# Altium schematic sheet lora.SchDoc
size A0
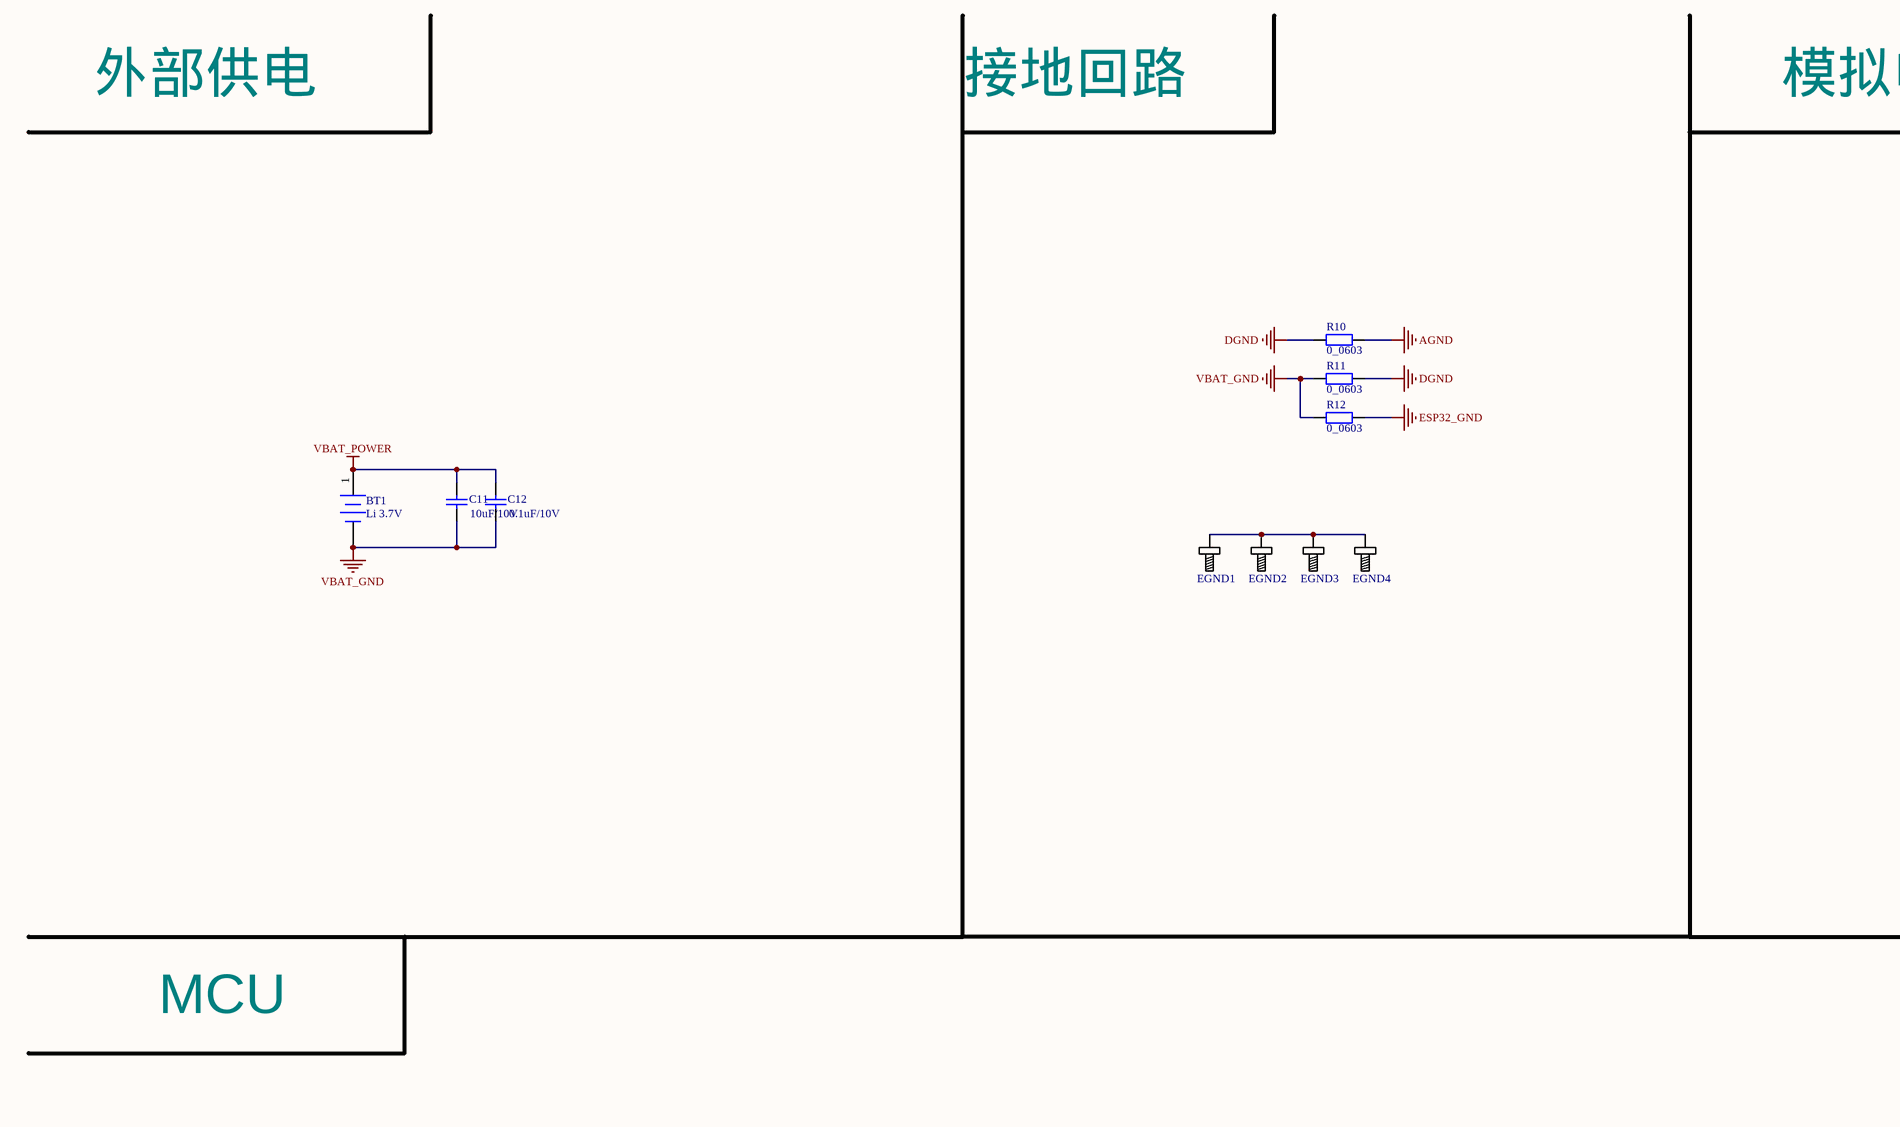
[diagram p0: lora.SchDoc, top left]
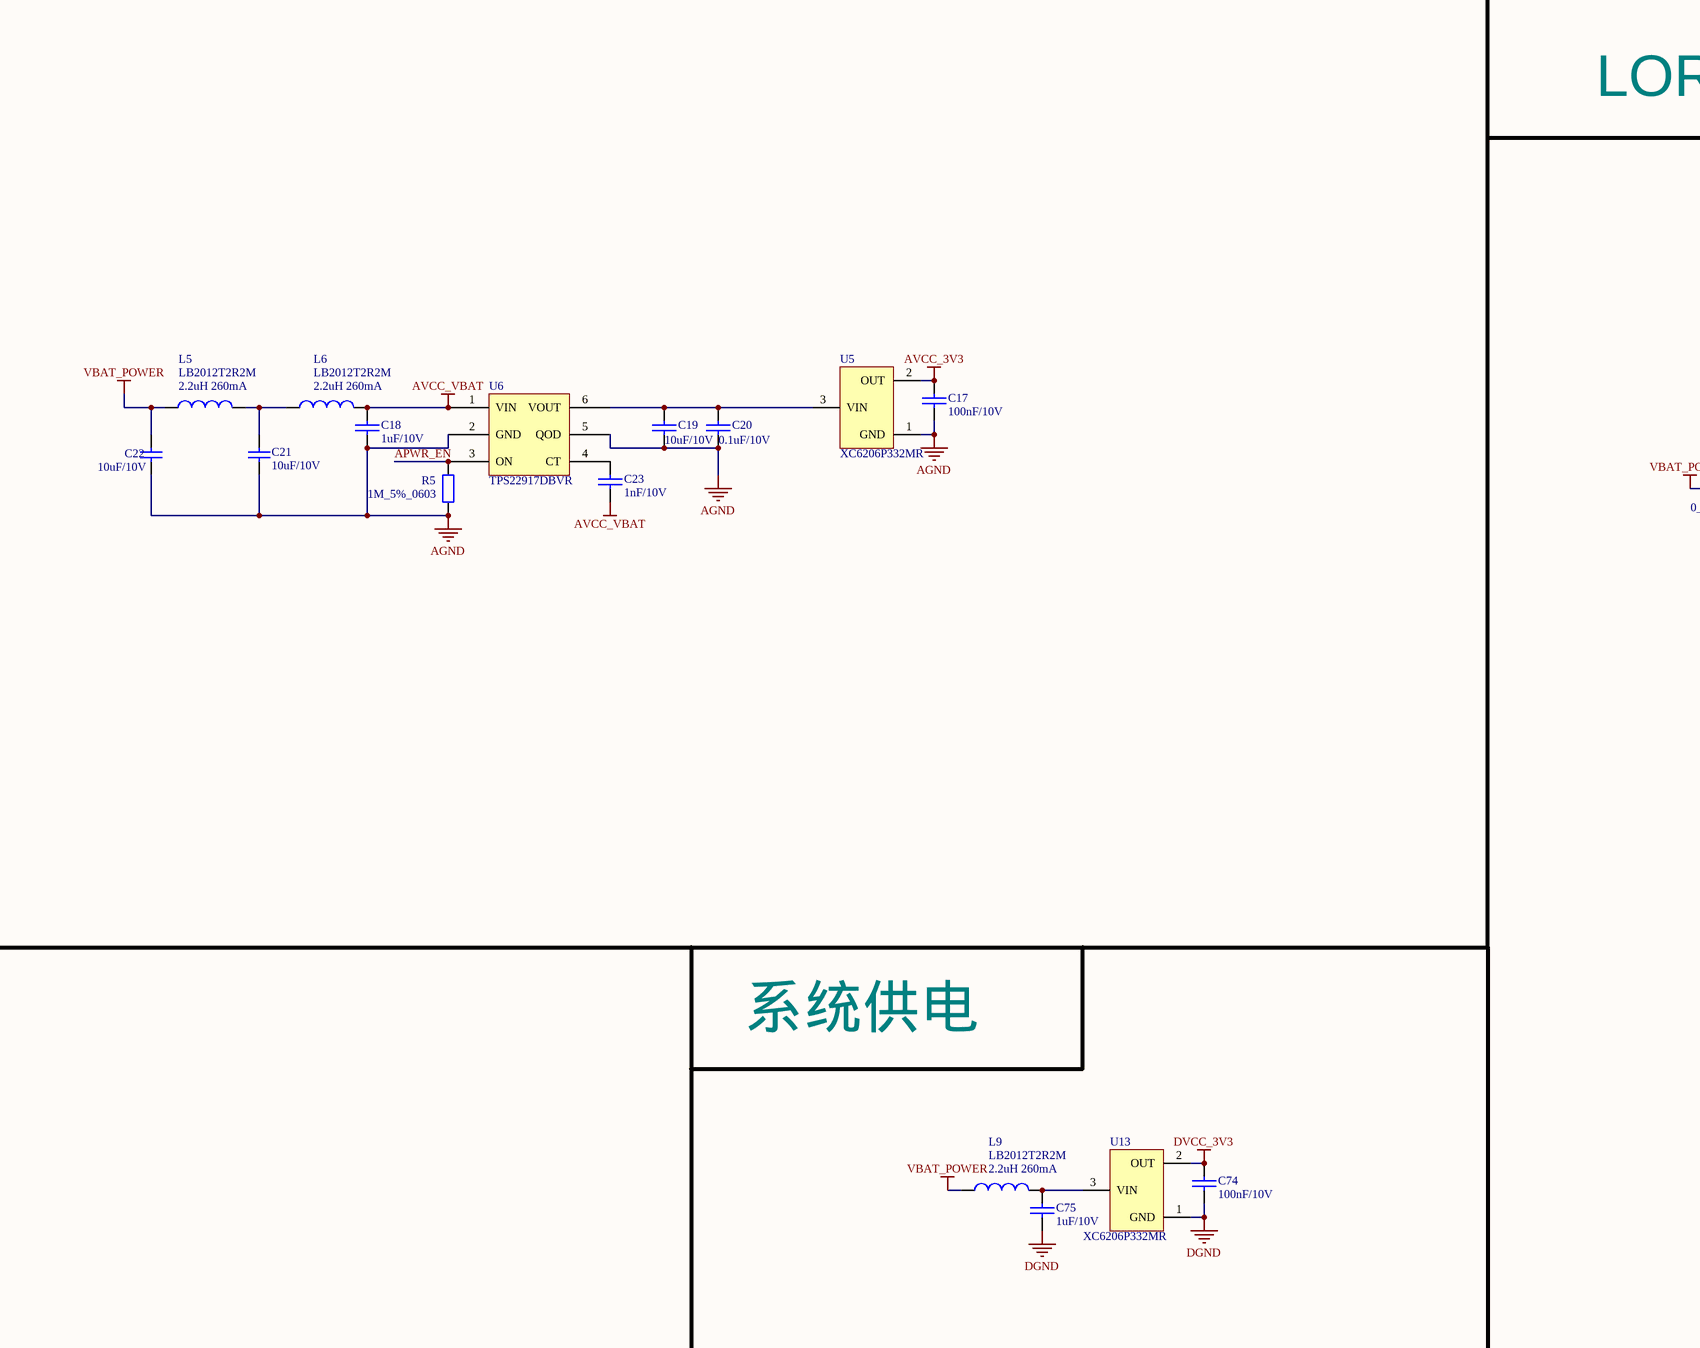
[diagram p1: lora.SchDoc, top middle]
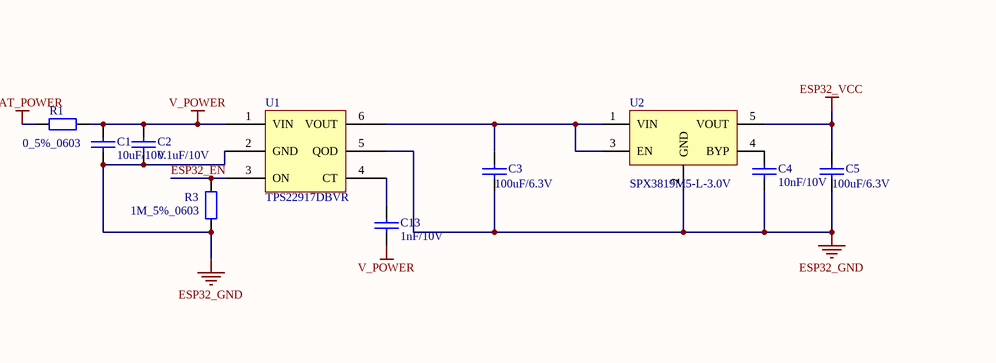
[diagram p2: lora.SchDoc, top right]
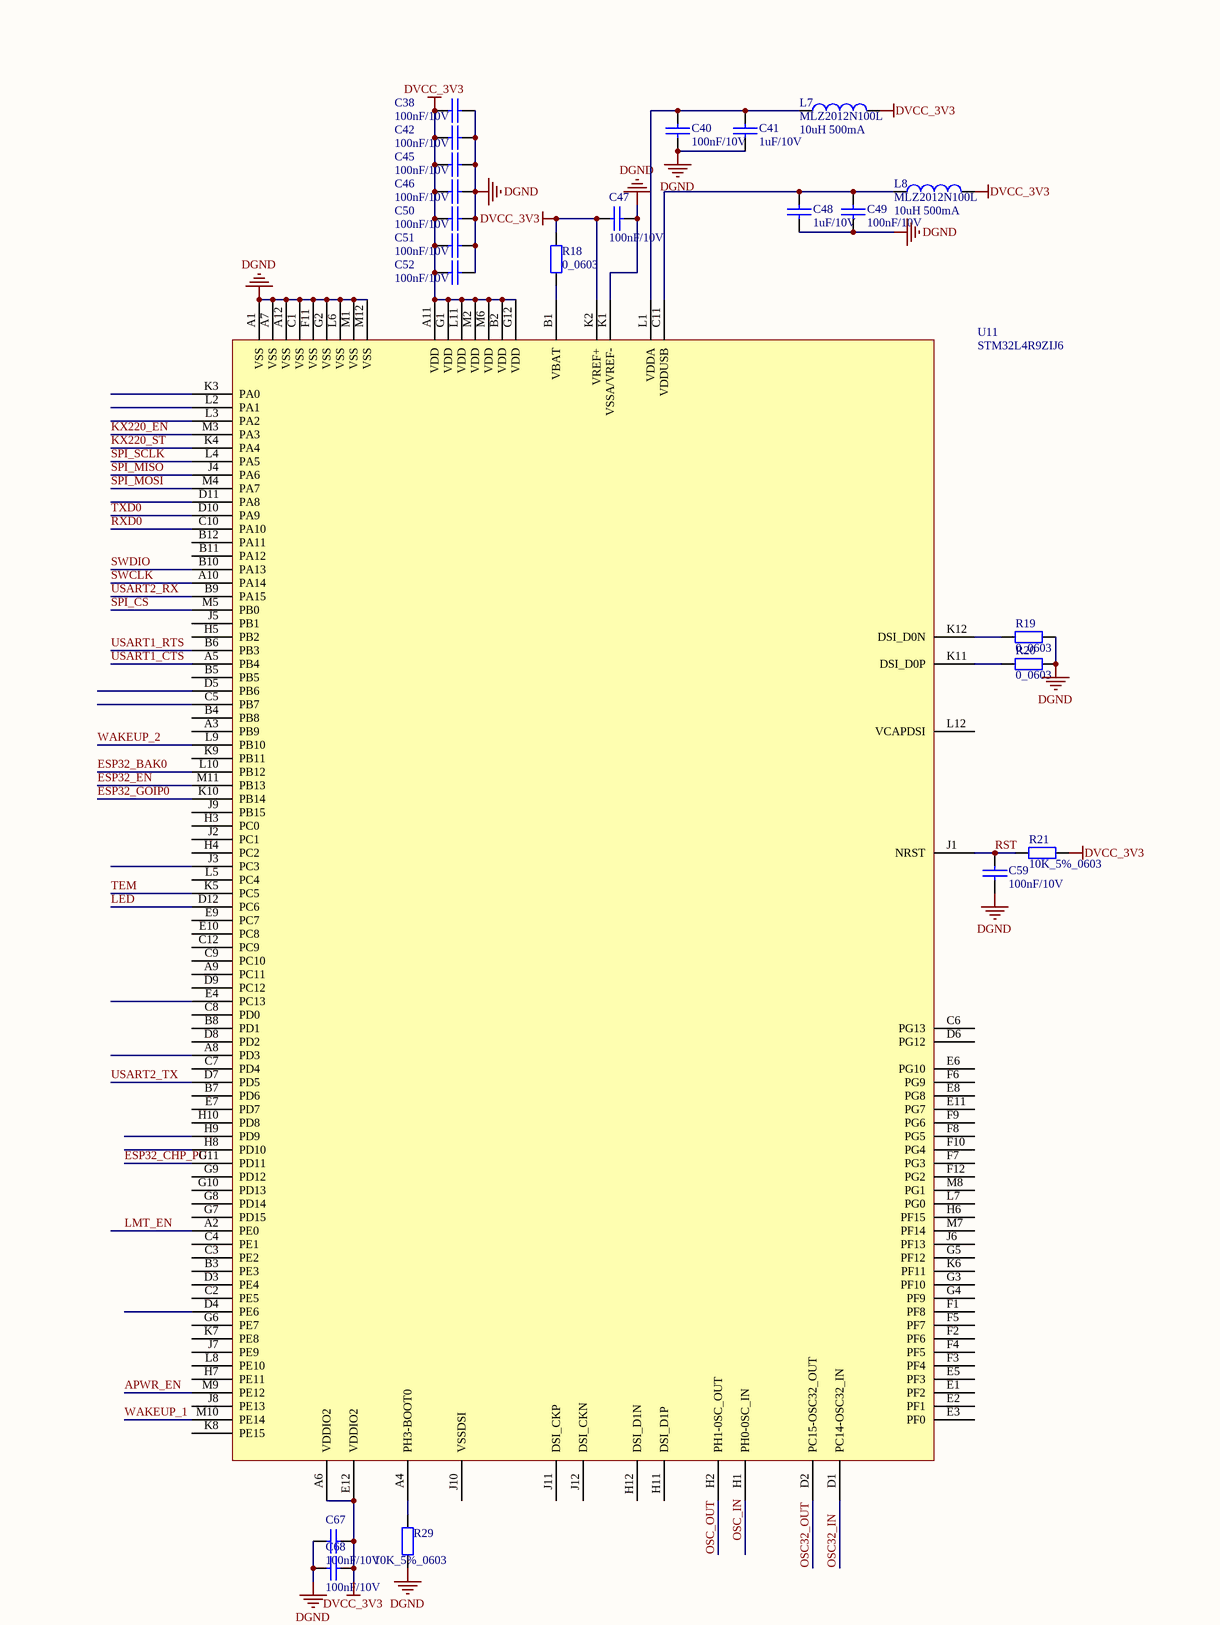
[diagram p3: lora.SchDoc, centre left]
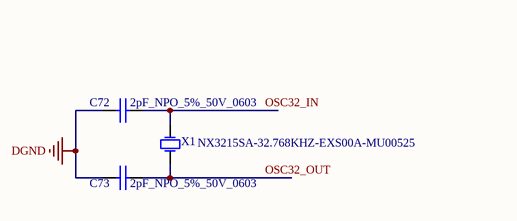
[diagram p4: lora.SchDoc, centre middle]
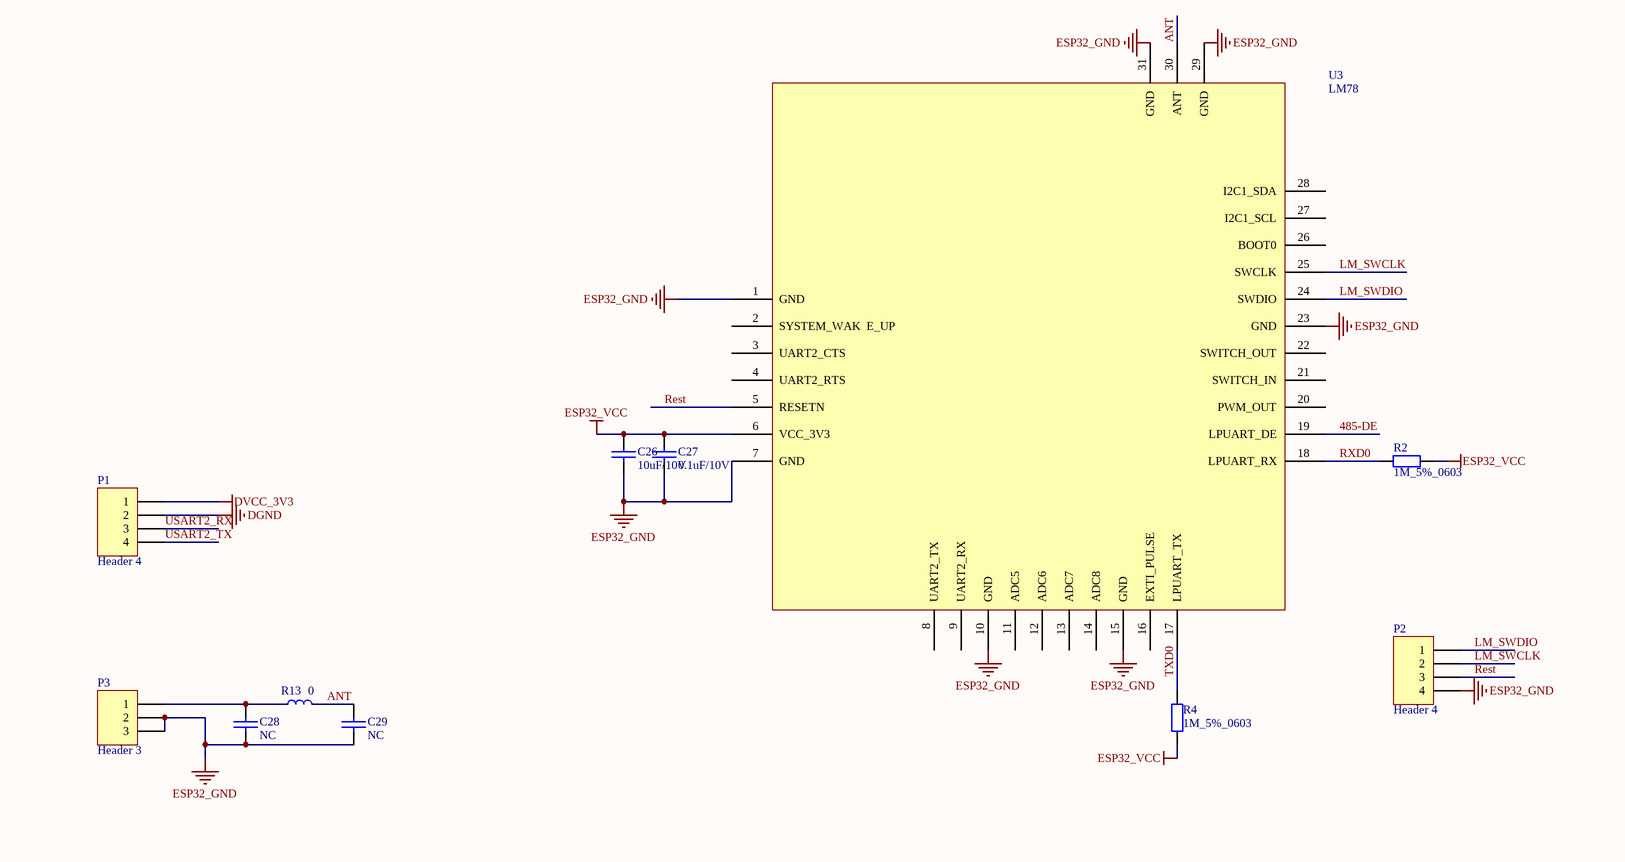
[diagram p5: lora.SchDoc, centre right]
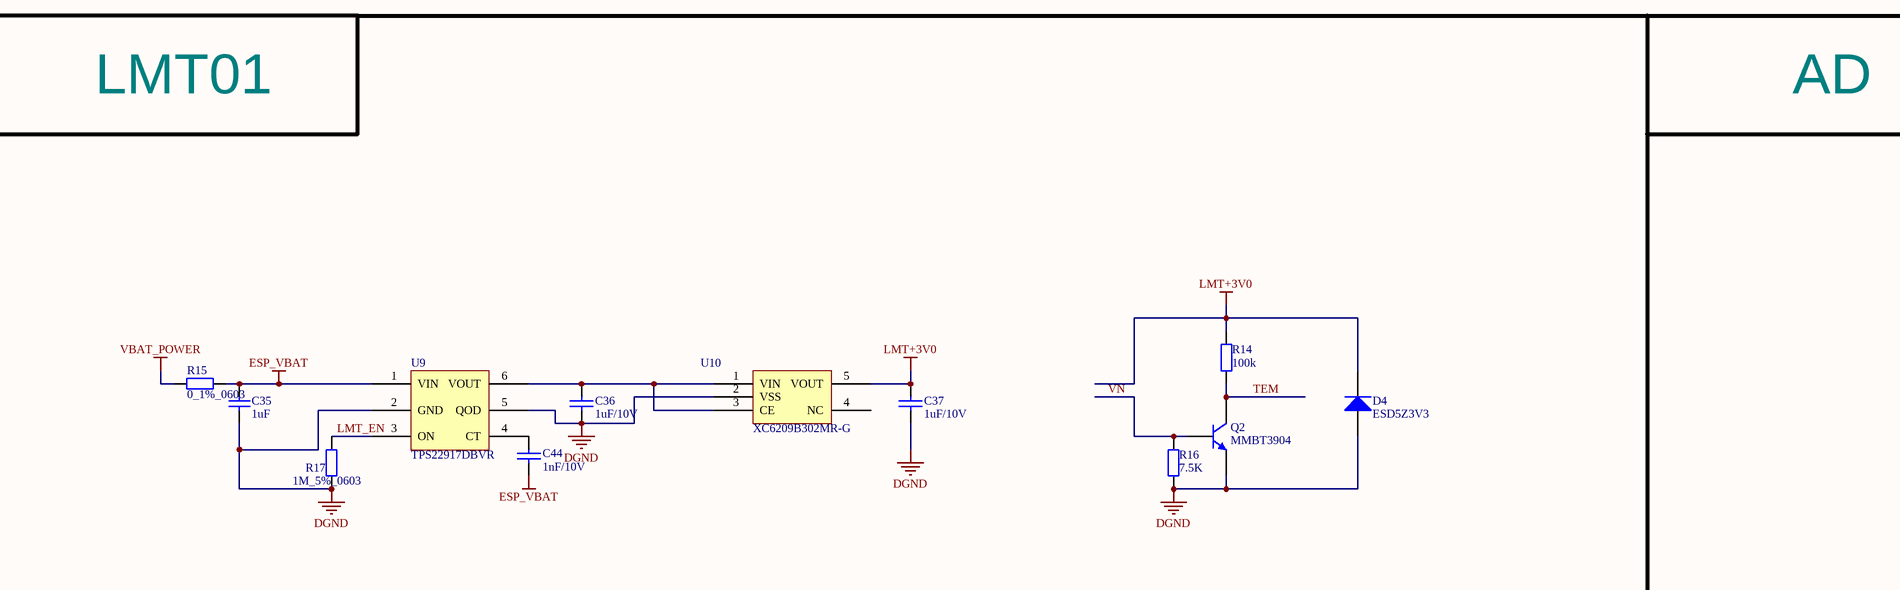
[diagram p6: lora.SchDoc, bottom left]
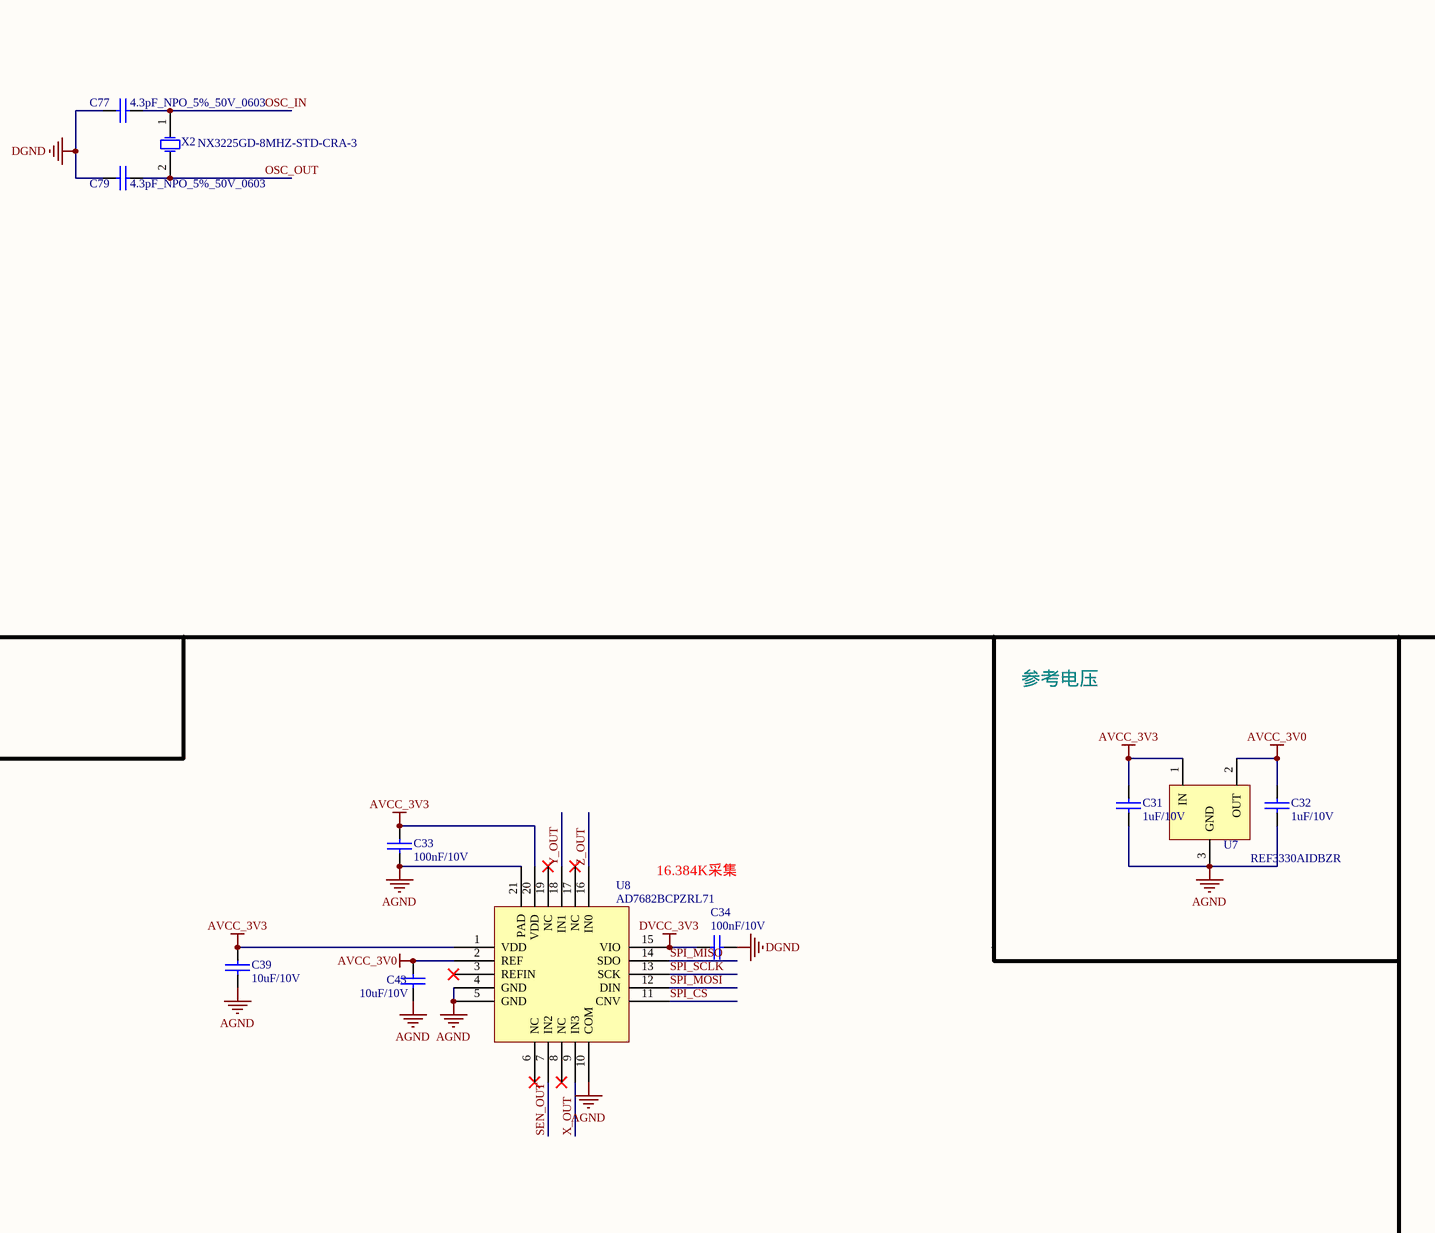
[diagram p7: lora.SchDoc, bottom middle]
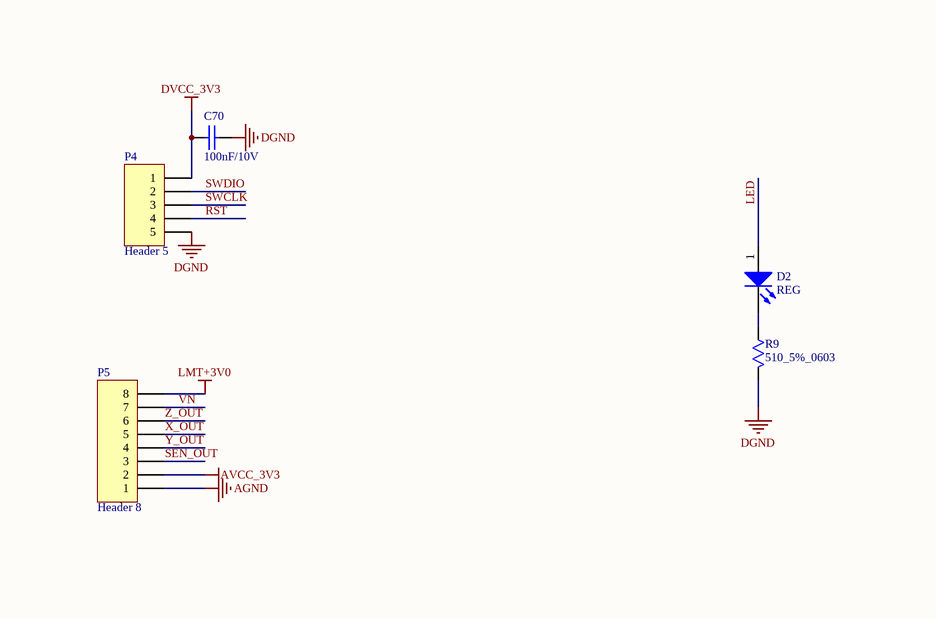
[diagram p8: lora.SchDoc, bottom right]

## Parts
BT1  Li 3.7V  [PH2.0-WI-2P]
C1  10uF/10V  [0603C]
C2  0.1uF/10V  [0603C]
C3  100uF/6.3V  [1206C]
C4  10nF/10V  [0603C]
C5  100uF/6.3V  [1206C]
C11  10uF/10V  [0603C]
C12  0.1uF/10V  [0603C]
C13  1nF/10V  [0603C]
C17  100nF/10V  [0603C]
C18  1uF/10V  [0603C]
C19  10uF/10V  [0603C]
C20  0.1uF/10V  [0603C]
C21  10uF/10V  [0603C]
C22  10uF/10V  [0603C]
C23  1nF/10V  [0603C]
C26  10uF/10V  [0603C]
C27  0.1uF/10V  [0603C]
C28  NC  [0603C]  (no BOM)
C29  NC  [0603C]  (no BOM)
C31  1uF/10V  [0603C]
C32  1uF/10V  [0603C]
C33  100nF/10V  [0402C]
C34  100nF/10V  [0603C]
C35  1uF  [0603C]
C36  1uF/10V  [0603C]
C37  1uF/10V  [0603C]
C38  100nF/10V  [0603C]
C39  10uF/10V  [0402C]
C40  100nF/10V  [0603C]
C41  1uF/10V  [0603C]
C42  100nF/10V  [0603C]
C43  10uF/10V  [0402C]
C44  1nF/10V  [0603C]
C45  100nF/10V  [0603C]
C46  100nF/10V  [0603C]
C47  100nF/10V  [0603C]
C48  1uF/10V  [0603C]
C49  100nF/10V  [0603C]
C50  100nF/10V  [0603C]
C51  100nF/10V  [0603C]
C52  100nF/10V  [0603C]
C59  100nF/10V  [0603C]
C67  100nF/10V  [0603C]
C68  100nF/10V  [0603C]
C70  100nF/10V  [0603C]
C72  2pF_NPO_5%_50V_0603  [0603C]
C73  2pF_NPO_5%_50V_0603  [0603C]
C74  100nF/10V  [0603C]
C75  1uF/10V  [0603C]
C77  4.3pF_NPO_5%_50V_0603  [0603C]
C79  4.3pF_NPO_5%_50V_0603  [0603C]
D2  REG  [LED 0805B]
D4  ESD5Z3V3  [SOD-523]
EGND1  EGND  [M2.5x4]  (value not drawn)  (no BOM)
EGND2  EGND  [M2.5x4]  (value not drawn)  (no BOM)
EGND3  EGND  [M2.5x4]  (value not drawn)  (no BOM)
EGND4  EGND  [M2.5x4]  (value not drawn)  (no BOM)
L5  LB2012T2R2M  value 2.2uH 260mA  [L 0805]
L6  LB2012T2R2M  value 2.2uH 260mA  [L 0805]
L7  MLZ2012N100L  value 10uH 500mA  [L 0805]
L8  MLZ2012N100L  value 10uH 500mA  [L 0805]
L9  LB2012T2R2M  value 2.2uH 260mA  [L 0805]
P1  Header 4  [HDR2.0-LI-4P]
P2  Header 4  [HDR2.0-LI-4P]
P3  Header 3  [SMA-KE]
P4  Header 5  [HDR2.0-LI-5P]
P5  Header 8  [FPC1.0-2H-WS-8P]
Q2  MMBT3904  [SOT23-3N]
R1  0_5%_0603  [0603R]
R2  1M_5%_0603  [0603R]
R3  1M_5%_0603  [0603R]
R4  1M_5%_0603  [0603R]
R5  1M_5%_0603  [0603R]
R9  510_5%_0603  [0603R]
R10  0_0603  [0603R]
R11  0_0603  [0603R]
R12  0_0603  [0603R]
R13  0  [0603R]
R14  100k  [0603R]
R15  0_1%_0603  [0603R]
R16  7.5K  [0603R]
R17  1M_5%_0603  [0603R]
R18  0_0603  [0603R]
R19  0_0603  [0603R]
R20  0_0603  [0603R]
R21  10K_5%_0603  [0603R]
R29  10K_5%_0603  [0603R]
U1  TPS22917DBVR  [SOT23-6]
U2  SPX3819M5-L-3.0V  [SOT23-5]
U3  LM78  [LM78]
U5  XC6206P332MR  [SOT23-3N]
U6  TPS22917DBVR  [SOT23-6]
U7  REF3330AIDBZR  [SOT23-3N]
U8  AD7682BCPZRL71  [LFCSP-20]
U9  TPS22917DBVR  [SOT23-6]
U10  XC6209B302MR-G  [SOT23-5]
U11  STM32L4R9ZIJ6  [UFBGA144]
U13  XC6206P332MR  [SOT23-3N]
X1  NX3215SA-32.768KHZ-EXS00A-MU00525  [OSC 3215-2P]
X2  NX3225GD-8MHZ-STD-CRA-3  [OSC 3225-2P]

## Nets
AGND: C17.2 C18.2 C19.2 C20.2 C21.2 C22.2 C31.2 C32.2 C33.2 C39.2 C43.2 P5.1 R5.2 R10.1 U5.1(GND) U6.2(GND) U6.5(QOD) U7.3(GND) U8.4(GND) U8.5(GND) U8.10(COM) U8.21(PAD)
AVCC_3V0: C32.1 C43.1 U7.2(OUT) U8.2(REF)
AVCC_3V3: C17.1 C31.1 C33.1 C39.1 P5.2 U5.2(OUT) U7.1(IN) U8.1(VDD) U8.20(VDD)
AVCC_VBAT: C18.1 C23.2 L6.2 U6.1(VIN)
DGND: C34.2 C35.2 C36.2 C37.2 C38.1 C40.2 C41.1 C42.1 C45.1 C46.1 C47.2 C48.2 C49.2 C50.1 C51.1 C52.1 C59.1 C67.2 C68.2 C70.2 C72.2 C73.2 C74.2 C75.2 C77.2 C79.2 D4.1(A) P1.2 P4.5 Q2.2(E) R9.2 R10.2 R11.1 R16.2 R17.2 R19.2 R20.2 R29.1 U9.2(GND) U9.5(QOD) U10.2(VSS) U11.A1(VSS) U11.A7(VSS) U11.A12(VSS) U11.C1(VSS) U11.F11(VSS) U11.G2(VSS) U11.K1(VSSA/VREF-) U11.L6(VSS) U11.M1(VSS) U11.M12(VSS) U13.1(GND)
DVCC_3V3: C34.1 C38.2 C42.2 C45.2 C46.2 C47.1 C50.2 C51.2 C52.2 C67.1 C68.1 C70.1 C74.1 L7.2 L8.2 P1.1 P4.1 R18.1 R21.1 U8.15(VIO) U11.A6(VDDIO2) U11.A11(VDD) U11.B2(VDD) U11.E12(VDDIO2) U11.G1(VDD) U11.G12(VDD) U11.K2(VREF+) U11.L11(VDD) U11.M2(VDD) U11.M6(VDD) U13.2(OUT)
ESP32_GND: C1.2 C2.2 C3.2 C4.2 C5.2 C26.2 C27.2 C28.2 C29.2 P2.4 P3.2 P3.3 R3.2 R12.1 U1.2(GND) U1.5(QOD) U2.2(GND) U3.1(GND) U3.7(GND) U3.10(GND) U3.15(GND) U3.23(GND) U3.29(GND) U3.31(GND)
ESP32_VCC: C5.1 C26.1 C27.1 R2.1 R4.1 U2.5(VOUT) U3.6(VCC_3V3)
ESP_VBAT: C35.1 C44.2 R15.2 U9.1(VIN)
LMT+3V0: C37.1 D4.2(K) P5.8 R14.1 U10.5(VOUT)
V_POWER: C1.1 C2.1 C13.2 R1.2 U1.1(VIN)
VBAT_GND: BT1.2(-) C11.1 C12.1 R11.2 R12.2
VBAT_POWER: BT1.1(+) C11.2 C12.2 C22.1 L5.1 L9.1 R1.1 R15.1
485-DE: U3.19(LPUART_DE)
ANT: C29.1 R13.1 U3.30(ANT)
APWR_EN: R5.1 U6.3(ON) U11.M9(PE12)
ESP32_BAK0: U11.L10(PB12)
ESP32_CHP_PU: U11.G11(PD11)
ESP32_EN: R3.1 U1.3(ON) U11.M11(PB13)
ESP32_GOIP0: U11.K10(PB14)
KX220_EN: U11.M3(PA3)
KX220_ST: U11.K4(PA4)
LED: D2.1(A) U11.D12(PC6)
LM_SWCLK: P2.2 U3.25(SWCLK)
LM_SWDIO: P2.1 U3.24(SWDIO)
LMT_EN: R17.1 U9.3(ON) U11.A2(PE0)
OSC32_IN: C72.1 U11.D1(PC14-OSC32_IN) X1.1(OSC1)
OSC32_OUT: C73.1 U11.D2(PC15-OSC32_OUT) X1.2(OSC2)
OSC_IN: C77.1 U11.H1(PH0-0SC_IN) X2.1(OSC1)
OSC_OUT: C79.1 U11.H2(PH1-0SC_OUT) X2.2(OSC2)
Rest: P2.3 U3.5(RESETN)
RST: C59.2 P4.4 R21.2 U11.J1(NRST)
RXD0: R2.2 U3.18(LPUART_RX) U11.C10(PA10)
SEN_OUT: P5.3 U8.7(IN2)
SPI_CS: U8.11(CNV) U11.M5(PB0)
SPI_MISO: U8.14(SDO) U11.J4(PA6)
SPI_MOSI: U8.12(DIN) U11.M4(PA7)
SPI_SCLK: U8.13(SCK) U11.L4(PA5)
SWCLK: P4.3 U11.A10(PA14)
SWDIO: P4.2 U11.B10(PA13)
TEM: Q2.3(C) R14.2 U11.K5(PC5)
TXD0: R4.2 U3.17(LPUART_TX) U11.D10(PA9)
USART1_CTS: U11.A5(PB4)
USART1_RTS: U11.B6(PB3)
USART2_RX: P1.3 U11.B9(PA15)
USART2_TX: P1.4 U11.D7(PD5)
VN: P5.7 Q2.1(B) R16.1
WAKEUP_1: U11.M10(PE14)
WAKEUP_2: U11.L9(PB10)
X_OUT: P5.5 U8.9(IN3)
Y_OUT: P5.4 U8.18(IN1)
Z_OUT: P5.6 U8.16(IN0)
NetC3_1: C3.1 U1.6(VOUT) U2.1(VIN) U2.3(EN)
NetC4_1: C4.1 U2.4(BYP)
NetC13_1: C13.1 U1.4(CT)
NetC19_1: C19.1 C20.1 U5.3(VIN) U6.6(VOUT)
NetC21_1: C21.1 L5.2 L6.1
NetC23_1: C23.1 U6.4(CT)
NetC28_1: C28.1 P3.1 R13.2
NetC36_1: C36.1 U9.6(VOUT) U10.1(VIN) U10.3(CE)
NetC40_1: C40.1 C41.2 L7.1 U11.L1(VDDA)
NetC44_1: C44.1 U9.4(CT)
NetC48_1: C48.1 C49.1 L8.1 U11.C11(VDDUSB)
NetC75_1: C75.1 L9.2 U13.3(VIN)
NetD2_2: D2.2(K) R9.1
NetEGND1_0: EGND1.0 EGND2.0 EGND3.0 EGND4.0
NetR18_2: R18.2 U11.B1(VBAT)
NetR19_1: R19.1 U11.K12(DSI_D0N)
NetR20_1: R20.1 U11.K11(DSI_D0P)
NetR29_2: R29.2 U11.A4(PH3-BOOT0)

Not connected (* = marked no-connect by the designer): U3 2(SYSTEM_WAK__E_UP) 3(UART2_CTS) 4(UART2_RTS) 8(UART2_TX) 9(UART2_RX) 11(ADC5) 12(ADC6) 13(ADC7) 14(ADC8) 16(EXTI_PULSE) 20(PWM_OUT) 21(SWITCH_IN) 22(SWITCH_OUT) 26(BOOT0) 27(I2C1_SCL) 28(I2C1_SDA); U8 3(REFIN)* 6(NC)* 8(NC)* 17(NC)* 19(NC)*; U10 4(NC); U11 A3(PB9) A8(PD3) A9(PC11) B3(PE3) B4(PB8) B5(PB5) B7(PD6) B8(PD1) B11(PA12) B12(PA11) C2(PE5) C3(PE2) C4(PE1) C5(PB7) C6(PG13) C7(PD4) C8(PD0) C9(PC10) C12(PC9) D3(PE4) D4(PE6) D5(PB6) D6(PG12) D8(PD2) D9(PC12) D11(PA8) E1(PF2) E2(PF1) E3(PF0) E4(PC13) E5(PF3) E6(PG10) E7(PD7) E8(PG8) E9(PC7) E10(PC8) E11(PG7) F1(PF8) F2(PF6) F3(PF4) F4(PF5) F5(PF7) F6(PG9) F7(PG3) F8(PG5) F9(PG6) F10(PG4) F12(PG2) G3(PF10) G4(PF9) G5(PF12) G6(PE7) G7(PD15) G8(PD14) G9(PD12) G10(PD13) H3(PC0) H4(PC2) H5(PB2) H6(PF15) H7(PE11) H8(PD10) H9(PD9) H10(PD8) H11(DSI_D1P) H12(DSI_D1N) J2(PC1) J3(PC3) J5(PB1) J6(PF13) J7(PE9) J8(PE13) J9(PB15) J10(VSSDSI) J11(DSI_CKP) J12(DSI_CKN) K3(PA0) K6(PF11) K7(PE8) K8(PE15) K9(PB11) L2(PA1) L3(PA2) L5(PC4) L7(PG0) L8(PE10) L12(VCAPDSI) M7(PF14) M8(PG1)

## Notes on the sheet
- 外部供电
- 接地回路
- 模拟电源
- LORA
- MCU
- 系统供电
- LMT01
- AD
- 参考电压
- (near U8) 16.384K采集

## Library data of the parts
BT1 = Battery: 能量型锂亚电池; Published: 24-Mar-1999; LatestRevisionDate: 17-Jul-2002; LatestRevisionNote: Re-released for DXP Platform.; PackageReference: BAT-2; Publisher: Altium Limited; PackageDescription: Battery; 2 Leads
C1 C19 C26 C39 C43 = CAP: 10uF_X5R_10%_10V_0603
C2 C20 C27 = CAP: 0.1uF_X5R_10%_10V_0603
C3 C5 = CAP: 100uF_X5R_20%_6.3V_1206
C4 = CAP: 10nF_X7R_10%_10V_0603
C11 = Cap: 10uF_X5R_10%_10V_0603; Value: 0.1uF/50V; Published: 8-Jun-2000; LatestRevisionDate: 17-Jul-2002; LatestRevisionNote: Re-released for DXP Platform.; PackageReference: RAD-0.3; Publisher: Altium Limited; PackageDescription: Radial Cap, Thru-Hole; 2 Leads; 0.3 in Pin Spacing
C12 = Cap: 0.1uF_X5R_10%_10V_0603; Published: 8-Jun-2000; LatestRevisionDate: 17-Jul-2002; LatestRevisionNote: Re-released for DXP Platform.; PackageReference: RAD-0.3; Publisher: Altium Limited; PackageDescription: Radial Cap, Thru-Hole; 2 Leads; 0.3 in Pin Spacing; Value: 0.1uF/10V
C13 C23 C44 = CAP: 1nF_X7R_10%_10V_0603
C17 C33 C34 C38 C40 C42 C45-C47 C49-C52 C59 C67 C68 C70 C74 = CAP: 100nF_X5R_10%_10V_0603
C18 C31 C32 C36 C37 C41 C48 C75 = CAP: 1uF_X5R_10%_10V_0603
C21 C22 = Cap: 10uF_X5R_10%_10V_0603; Value: 1uF/50V; Published: 8-Jun-2000; LatestRevisionDate: 17-Jul-2002; LatestRevisionNote: Re-released for DXP Platform.; PackageReference: RAD-0.3; Publisher: Altium Limited; PackageDescription: Radial Cap, Thru-Hole; 2 Leads; 0.3 in Pin Spacing
C28 C29 = CAP: 贴片电容; Text Field1: 11; Text Field2: 22; 0.1u: *
C35 = Cap: 1uF_X5R_10%_10V_0603; Published: 8-Jun-2000; LatestRevisionDate: 17-Jul-2002; LatestRevisionNote: Re-released for DXP Platform.; PackageReference: RAD-0.3; Publisher: Altium Limited; PackageDescription: Radial Cap, Thru-Hole; 2 Leads; 0.3 in Pin Spacing; Value: 1uF
C72 C73 C77 C79 = CAP
D2 = LED0: 贴片LED 蓝灯1206; Published: 8-Jun-2000; LatestRevisionDate: 08-Jul-2005; LatestRevisionNote: Mech Layer 1 removed.; PackageReference: LED-0; Publisher: Altium Limited; PackageDescription: LED; 2 Leads
D4 = DIODE: ESD二极管; Published: 8-Jun-2000; LatestRevisionDate: 17-Jul-2002; LatestRevisionNote: Re-released for DXP Platform.; PackageDocument: Sep-1996; PackageReference: SMC; Publisher: Altium Limited; Code_JEDEC: DO-214-AB
EGND1-EGND4 = Screw_M3: M3铜柱，长：4mm
L5 = Inductor: 固定电感器0805; Code_IEC: 1005; Published: 8-Jun-2000; LatestRevisionDate: 29-May-2009; LatestRevisionNote: IPC-7351 Footprint Added.; PackageReference: 0402-A; Publisher: Altium Limited; PackageDescription: Chip Inductor; Code_JEITA: 0402
L6 L9 = Inductor: Taiyo Yuden固定电感器0805; Code_IEC: 1005; Published: 8-Jun-2000; LatestRevisionDate: 29-May-2009; LatestRevisionNote: IPC-7351 Footprint Added.; PackageReference: 0402-A; Publisher: Altium Limited; PackageDescription: Chip Inductor; Code_JEITA: 0402
L7 L8 = Inductor: TDK固定电感器10uH; Code_IEC: 1005; Published: 8-Jun-2000; LatestRevisionDate: 29-May-2009; LatestRevisionNote: IPC-7351 Footprint Added.; PackageReference: 0402-A; Publisher: Altium Limited; PackageDescription: Chip Inductor; Code_JEITA: 0402
P1 P2 = Header 4: Header, 4-Pin; LatestRevisionDate: 17-Jul-2002; LatestRevisionNote: Re-released for DXP Platform.; Publisher: Altium Limited
P3 = Header 3: SMA 偏脚射频天线座 1.6mm; LatestRevisionDate: 17-Jul-2002; LatestRevisionNote: Re-released for DXP Platform.; Publisher: Altium Limited
P4 = Header 5: Header, 5-Pin; LatestRevisionDate: 17-Jul-2002; LatestRevisionNote: Re-released for DXP Platform.; Publisher: Altium Limited
P5 = Header 8: Header, 8-Pin; LatestRevisionDate: 17-Jul-2002; LatestRevisionNote: Re-released for DXP Platform.; Publisher: Altium Limited
Q2 = 2N3904: 三极管_NPN; Published: 8-Jun-2000; LatestRevisionDate: 15-Jan-2003; LatestRevisionNote: PCB Footprint 'BCY-W3/D4.7' replaced; DatasheetVersion: 1997; PackageVersion: Sep-1998; PackageReference: TO-92A; Publisher: Altium Limited; Code_JEDEC: TO-92A; ComponentLink1Description: Manufacturer Link; ComponentLink1URL: http://www.fairchildsemi.com/; ComponentLink2Description: Datasheet; ComponentLink2URL: http://www.fairchildsemi.com/ds/2N%2F2N3904.pdf
R1 = Res2: 1M_5%_0603; Value: 1M; Published: 8-Jun-2000; LatestRevisionDate: 17-Jul-2002; LatestRevisionNote: Re-released for DXP Platform.; PackageReference: AXIAL-0.4; Publisher: Altium Limited
R2-R5 R17 = Res2: Value: 1M; Published: 8-Jun-2000; LatestRevisionDate: 17-Jul-2002; LatestRevisionNote: Re-released for DXP Platform.; PackageReference: AXIAL-0.4; Publisher: Altium Limited
R9 = RES
R10-R12 = Res2: Value: 0; Published: 8-Jun-2000; LatestRevisionDate: 17-Jul-2002; LatestRevisionNote: Re-released for DXP Platform.; PackageReference: AXIAL-0.4; Publisher: Altium Limited
R13 = L0.2
R14 = Res2: 100K_1%_0603; Value: 7.5K; Published: 8-Jun-2000; LatestRevisionDate: 17-Jul-2002; LatestRevisionNote: Re-released for DXP Platform.; PackageReference: AXIAL-0.4; Publisher: Altium Limited
R15 = Res2: Published: 8-Jun-2000; LatestRevisionDate: 17-Jul-2002; LatestRevisionNote: Re-released for DXP Platform.; Publisher: Altium Limited
R16 = Res2: 7.5K_1%_0603; Published: 8-Jun-2000; LatestRevisionDate: 17-Jul-2002; LatestRevisionNote: Re-released for DXP Platform.; PackageReference: AXIAL-0.4; Publisher: Altium Limited; Value: 7.5K
R18-R21 R29 = Res2: 贴片电阻0603; Value: 10K; Published: 8-Jun-2000; LatestRevisionDate: 17-Jul-2002; LatestRevisionNote: Re-released for DXP Platform.; PackageReference: AXIAL-0.4; Publisher: Altium Limited
U1 U6 U9 = TPS22917DBVR: 1V 至 5.5V、2A、80mΩ 超低泄漏负载开关
U2 = CAT6219: 低压差700mVLDO SOT23-5; Modified Date: 2012/12/9
U3 = LM78: Lora模块 LoRaWAN LM78 天津中科智城网络技术有限公司 LM78
U5 = XC6206P282R: 低压差线性稳压(LDO)_SOT23; Modified Date: 2012/9/18
U7 = R: 参考电压 3V 5mA; Modified Date: 2012/9/18
U8 = AD7682BCPZRL71: ADI 16位 250KSPS PulSAR数模转换器
U10 = XC6209B332-G: 低压差线性稳压(LDO)
U11 = Component_1
U13 = XC6206P282R: 贴片集成电路; Modified Date: 2012/9/18
X1 = XTAL_5032_2P: 无源晶振 32.768KHz 10ppm; Value: 32.768K 5ppm
X2 = XTAL: NDK无源晶振 8MHz; Published: 8-Jun-2000; LatestRevisionDate: 17-Jul-2002; LatestRevisionNote: Re-released for DXP Platform.; PackageReference: R38; Publisher: Altium Limited